# EAGLE design rev_1_4 (EAGLE 7.7.0)
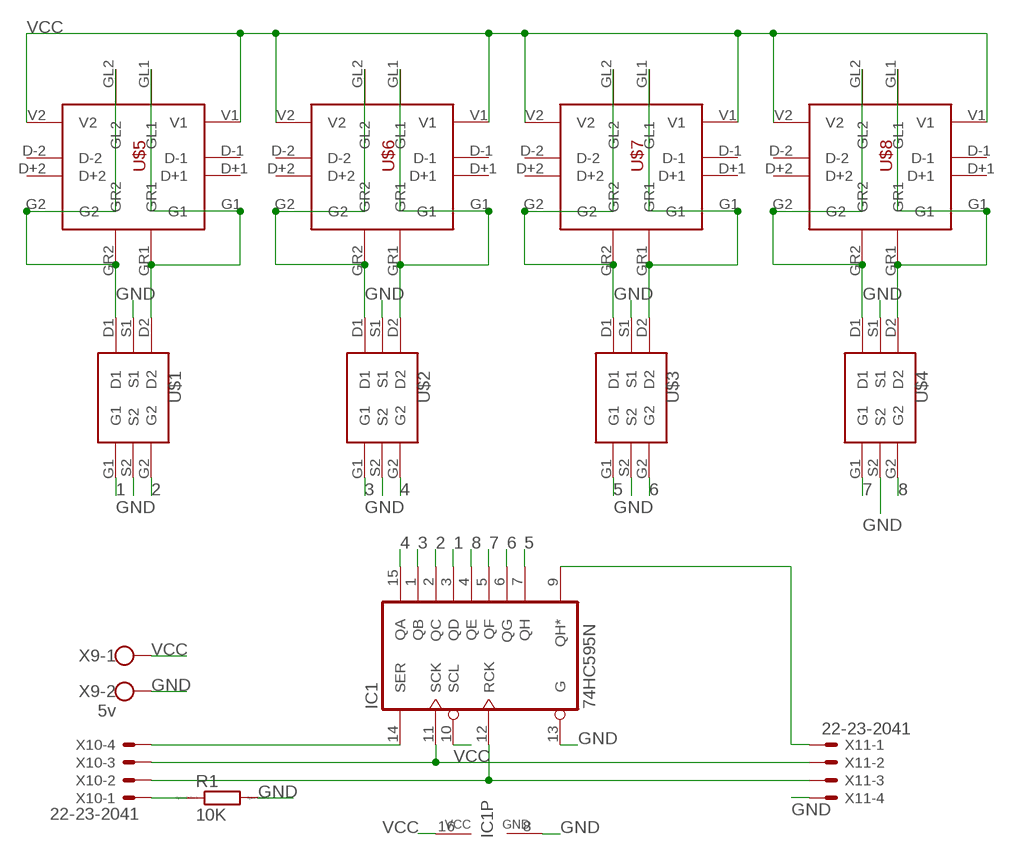
[diagram p0: schematic, sheet 1]

## Parts
IC1  74HC595N  [DIL16]
R1  10K  R0204/7  [0204/7]
U$1  FDC6305N  [FDC6305]
U$2  FDC6305N  [FDC6305]
U$3  FDC6305N  [FDC6305]
U$4  FDC6305N  [FDC6305]
U$5  USB2V  [USB2V]
U$6  USB2V  [USB2V]
U$7  USB2V  [USB2V]
U$8  USB2V  [USB2V]
X9  5v  W237-102  [W237-102]
X10  22-23-2041  [22-23-2041]
X11  22-23-2041  [22-23-2041]

## Nets
1: IC1.3(QD) U$1.G1
2: IC1.2(QC) U$1.G2
3: IC1.1(QB) U$2.G1
4: IC1.15(QA) U$2.G2
5: IC1.7(QH) U$3.G1
6: IC1.6(QG) U$3.G2
7: IC1.5(QF) U$4.G1
8: IC1.4(QE) U$4.G2
GND: IC1.8(GND) IC1.13(G) R1.2 U$1.S1 U$1.S2 U$2.S1 U$2.S2 U$3.S1 U$3.S2 U$4.S1 U$4.S2 X9.2 X11.4
N$1: U$1.D1 U$5.G2 U$5.GL2 U$5.GR2
N$2: U$1.D2 U$5.G1 U$5.GL1 U$5.GR1
N$3: U$2.D1 U$6.G2 U$6.GL2 U$6.GR2
N$4: U$2.D2 U$6.G1 U$6.GL1 U$6.GR1
N$5: U$3.D1 U$7.G2 U$7.GL2 U$7.GR2
N$6: U$3.D2 U$7.G1 U$7.GL1 U$7.GR1
N$7: U$4.D1 U$8.G2 U$8.GL2 U$8.GR2
N$8: U$4.D2 U$8.G1 U$8.GL1 U$8.GR1
N$17: R1.1 X10.1
N$19: IC1.9(QH*) X11.1
N$20: IC1.14(SER) X10.4
N$22: IC1.11(SCK) X10.3 X11.2
N$23: IC1.12(RCK) X10.2 X11.3
VCC: IC1.10(SCL) IC1.16(VCC) U$5.V1 U$5.V2 U$6.V1 U$6.V2 U$7.V1 U$7.V2 U$8.V1 U$8.V2 X9.1
Unconnected: U$5.D+1 U$5.D+2 U$5.D-1 U$5.D-2 U$6.D+1 U$6.D+2 U$6.D-1 U$6.D-2 U$7.D+1 U$7.D+2 U$7.D-1 U$7.D-2 U$8.D+1 U$8.D+2 U$8.D-1 U$8.D-2

## Library data of the parts
IC1 = 74xx-eu:74*595: 8-bit SHIFT REGISTER, output latch
R1 = eagle-ltspice:R: RESISTOR, European symbol; SPICEMODEL: NONE; SPICEPREFIX: R
U$1-U$4 = FDC6305N:FDC6305N
U$5-U$8 = USB2V:USB2V
X9 = con-wago-500:W237-102: WAGO SCREW CLAMP; MPN: 237-102; OC_FARNELL: unknown; OC_NEWARK: 70K9898
X10 X11 = con-molex:22-23-2041: .100" (2.54mm) Center Header - 4 Pin; MF: MOLEX; MPN: 22-23-2041; OC_FARNELL: 1462920; OC_NEWARK: 38C0355

## Board
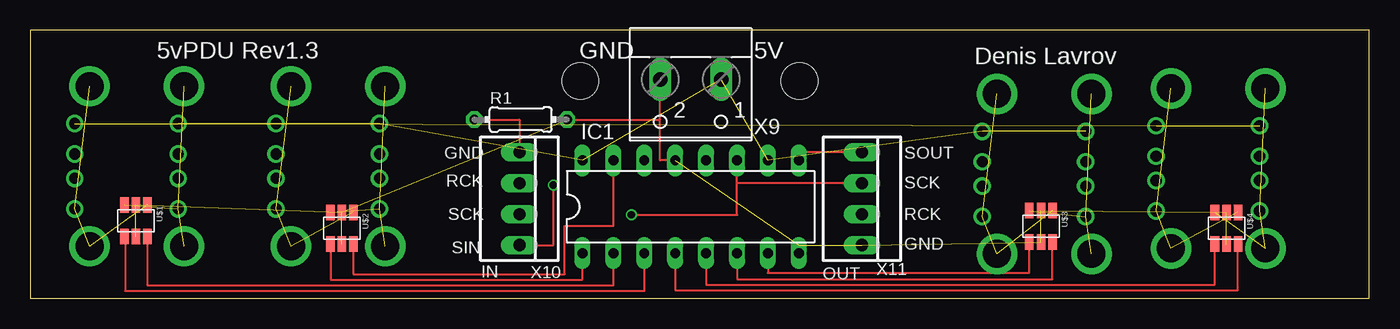
[diagram p1: board, top side]
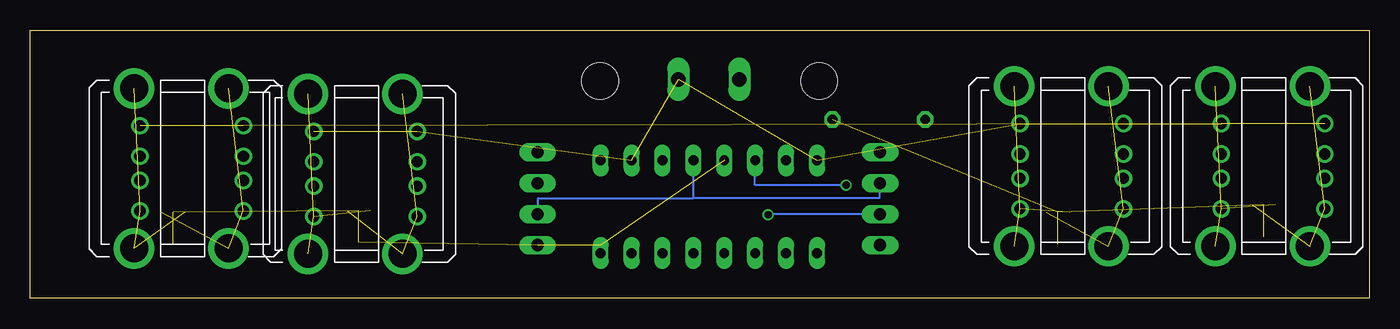
[diagram p2: board, bottom side, seen from below]

Size 110 x 22 mm. Coordinates in mm from the lower left corner, seen from the top.
Outline: 0,0 110,0 110,22 0,22 0,0
Copper layers (1*16): Top 0.035mm / dielectric 1.5mm / Bottom 0.035mm
Design rules "SeeedStudio_2layer_DRU_no_angle_20140221": minimum track width 6mil, minimum drill 12mil, track to track 6mil, track to pad 6mil, pad to pad 6mil, via to via 6mil, smd to smd 0mil, copper to edge 10mil, drill to drill 10mil, minimum pad ring 10mil, minimum via ring 6mil, stop-mask expansion 2mil, vias tented up to drill 100mil, thermal gap 10mil
Holes 3 mm at 63.18,17.85 45.18,17.85

### Footprints (pad centres in the part's own frame; a part is rotated, then mirrored left to right if it is on the bottom)
DIL16 = drill 0.813 long: 1 -8.89,-3.81; 2 -6.35,-3.81; 3 -3.81,-3.81; 4 -1.27,-3.81; 5 1.27,-3.81; 6 3.81,-3.81; 7 6.35,-3.81; 8 8.89,-3.81; 9 8.89,3.81; 10 6.35,3.81; 11 3.81,3.81; 12 1.27,3.81; 13 -1.27,3.81; 14 -3.81,3.81; 15 -6.35,3.81; 16 -8.89,3.81
0204/7 = drill 0.813 octagon: 1 -3.81,0; 2 3.81,0
FDC6305 = smd 1.27 x 0.7: D1 -0.4,0.55; D2 -0.4,2.45; G1 2.2,0.55; G2 2.2,2.45; S1 -0.4,1.5; S2 2.2,1.5
USB2V = drill 0.92: D+1 1,8.5; D+2 1,0; D-1 -1,8.5; D-2 -1,0; G1 3.5,8.5; G2 3.5,0; V1 -3.5,8.5; V2 -3.5,0 | drill 2.3: GL1 -6.57,7.28; GL2 -6.57,-0.48; GR1 6.57,7.28; GR2 6.57,-0.48
W237-102 = drill 1.194 long: 1 -2.5,-1.27; 2 2.5,-1.27
22-23-2041 = drill 1 long: 1 -3.81,0; 2 -1.27,0; 3 1.27,0; 4 3.81,0

### Placement (x,y rotation side)
IC1  54.25,7.52 0 top
R1  40.28,14.68 0 top
U$1  7.16,7.26 270 top
U$2  24.08,6.65 270 top
U$3  81.53,6.81 270 top
U$4  96.77,6.65 270 top
U$5  12.14,10.85 270 bottom
U$6  28.68,10.85 270 bottom
U$7  86.72,10.21 270 bottom
U$8  101,10.67 270 bottom
X9  54.25,16.71 180 top
X10  40.18,8.18 270 top
X11  68.33,8.18 270 top

### Tracks (layer width: path | path; a pad name or v marks a point on that pad's centre or on a via)
1
  Top 0.152: 7.77,4.91 7.77,0.61 50.44,0.61 IC1.3
  Top 0.406: 7.77,4.91 7.71,4.91 U$1.G1
2
  Top 0.152: U$1.G2 9.6,1.07 47.9,1.07 IC1.2
  Top 0.406: U$1.G2
3
  Top 0.152: U$2.G1 24.69,3.54 24.69,1.52 45.36,1.52 IC1.1
4
  Top 0.152: U$2.G2 26.52,3.54 26.52,1.98 43.89,1.98 43.89,5.94 47.9,5.94 IC1.15
5
  Top 0.152: IC1.7 60.6,2.08 82.08,2.08 U$3.G1
6
  Top 0.152: IC1.6 58.06,1.57 83.98,1.57 U$3.G2
7
  Top 0.152: IC1.5 55.52,1.12 97.32,1.12 U$4.G1
8
  Top 0.152: IC1.4 52.98,0.66 99.22,0.66 U$4.G2
GND  (10 unrouted)
  Top 0.152: IC1.13 51.75,11.33 51.75,14.68 | 51.75,14.68 X9.2 | R1.2 51.75,14.68 | 63.14,4.37 IC1.8
N$1  (3 unrouted)
N$2  (3 unrouted)
N$3  (3 unrouted)
N$4  (3 unrouted)
N$5  (3 unrouted)
N$6  (3 unrouted)
N$7  (3 unrouted)
N$8  (3 unrouted)
N$17
  Top 0.152: R1.1 40.18,14.68 X10.1
N$19
  Top 0.152: X11.1 63.14,11.99 IC1.9
N$20  (via drill 0.6)
  Top 0.152: X10.4 42.98,4.37 v42.98,9.3
  Bottom 0.152: v42.98,9.3 50.44,9.3 IC1.14
N$22  (via drill 0.6)
  Top 0.152: X11.2 58.06,9.45 | 58.06,9.45 IC1.11 | 58.06,9.45 58.06,6.86 v49.38,6.86
  Bottom 0.152: X10.3 49.38,6.91 v49.38,6.86
N$23
  Bottom 0.152: X10.2 40.23,9.45 40.23,8.23 55.52,8.23 | 55.52,8.23 IC1.12 | X11.3 68.28,6.91 68.28,8.23 55.52,8.23
VCC  (10 unrouted)

### Text on the board
tPlace: 5vPDU Rev1.3 | GND | 5V | Denis Lavrov | GND | SOUT | RCK | SCK | SCK | RCK | SIN | GND | IN | OUT